# EAGLE design debug-board (EAGLE 9.6.2)
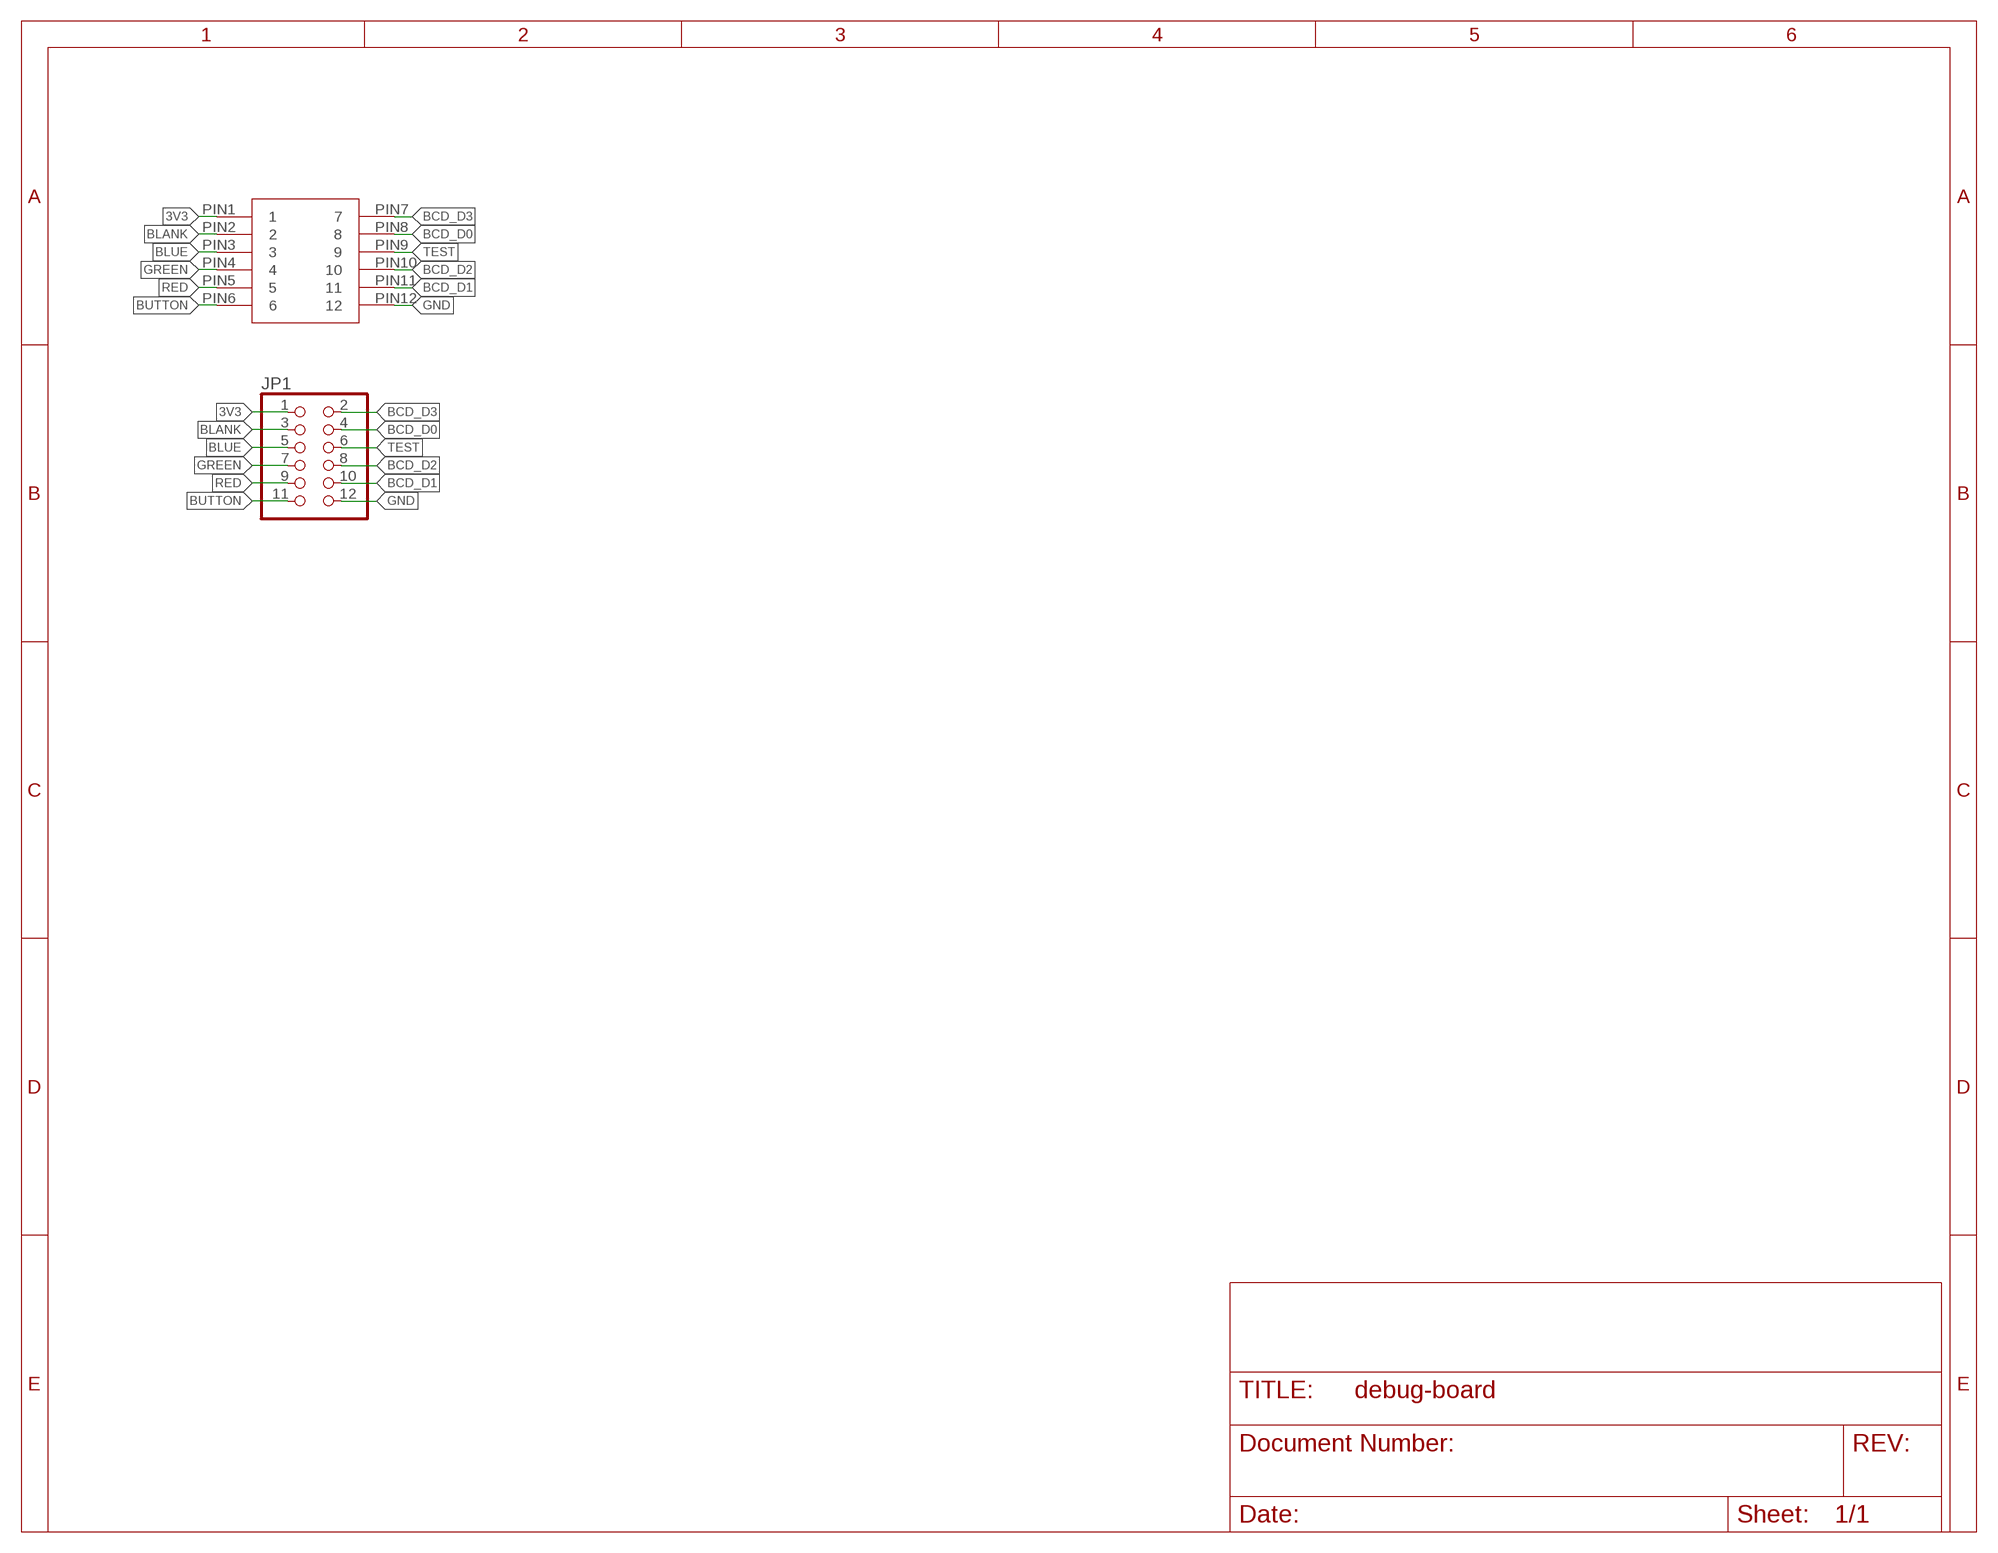
[diagram p0: schematic, sheet 1]

## Parts
JP1  PINHD-2X6  [2X06]
U$1  5650118-3  [5650118-3]

## Nets
3V3: JP1.1 U$1.PIN1
BCD_D0: JP1.4 U$1.PIN8
BCD_D1: JP1.10 U$1.PIN11
BCD_D2: JP1.8 U$1.PIN10
BCD_D3: JP1.2 U$1.PIN7
BLANK: JP1.3 U$1.PIN2
BLUE: JP1.5 U$1.PIN3
BUTTON: JP1.11 U$1.PIN6
GND: JP1.12 U$1.PIN12
GREEN: JP1.7 U$1.PIN4
RED: JP1.9 U$1.PIN5
TEST: JP1.6 U$1.PIN9

## Library data of the parts
JP1 = pinhead:PINHD-2X6: PIN HEADER
U$1 = 5650118-3:5650118-3

## Board
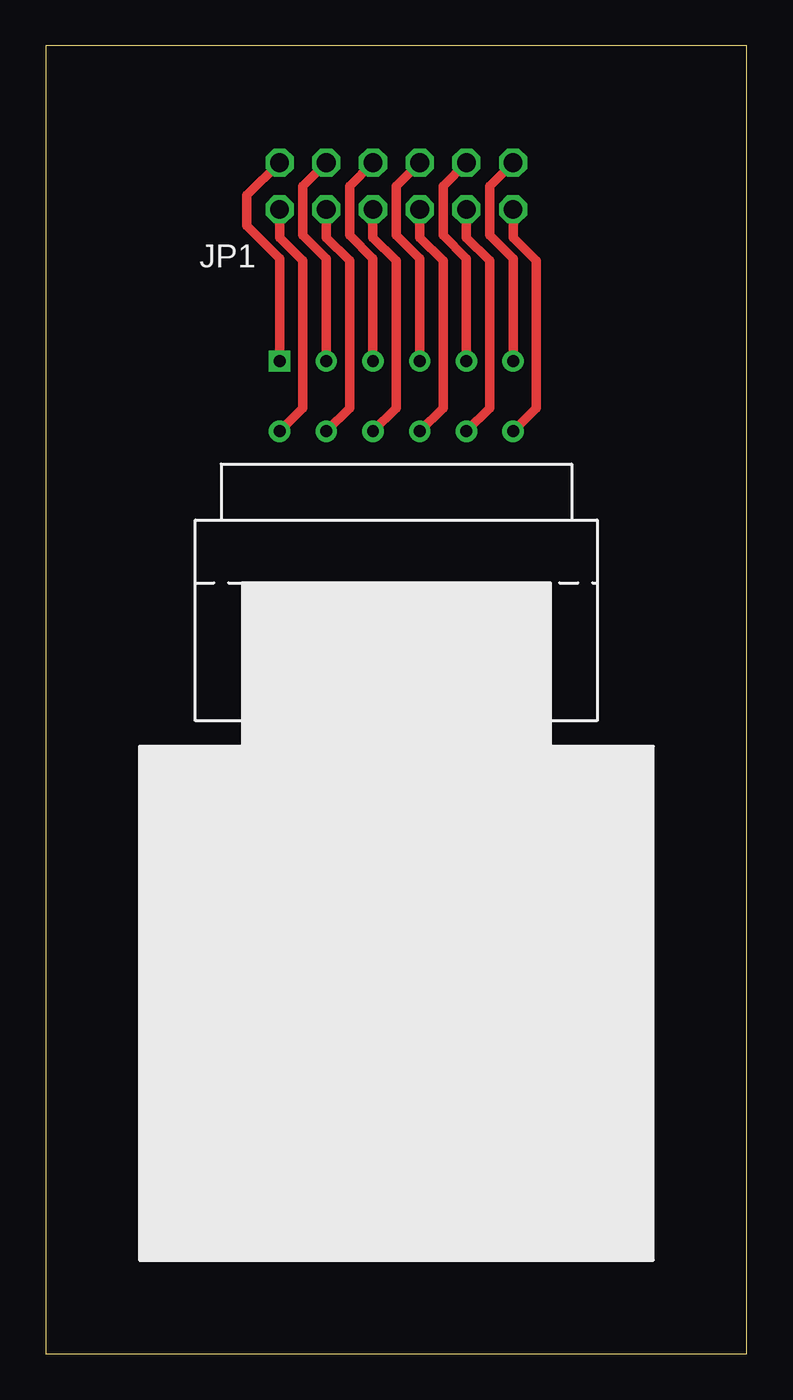
[diagram p1: board, top side]
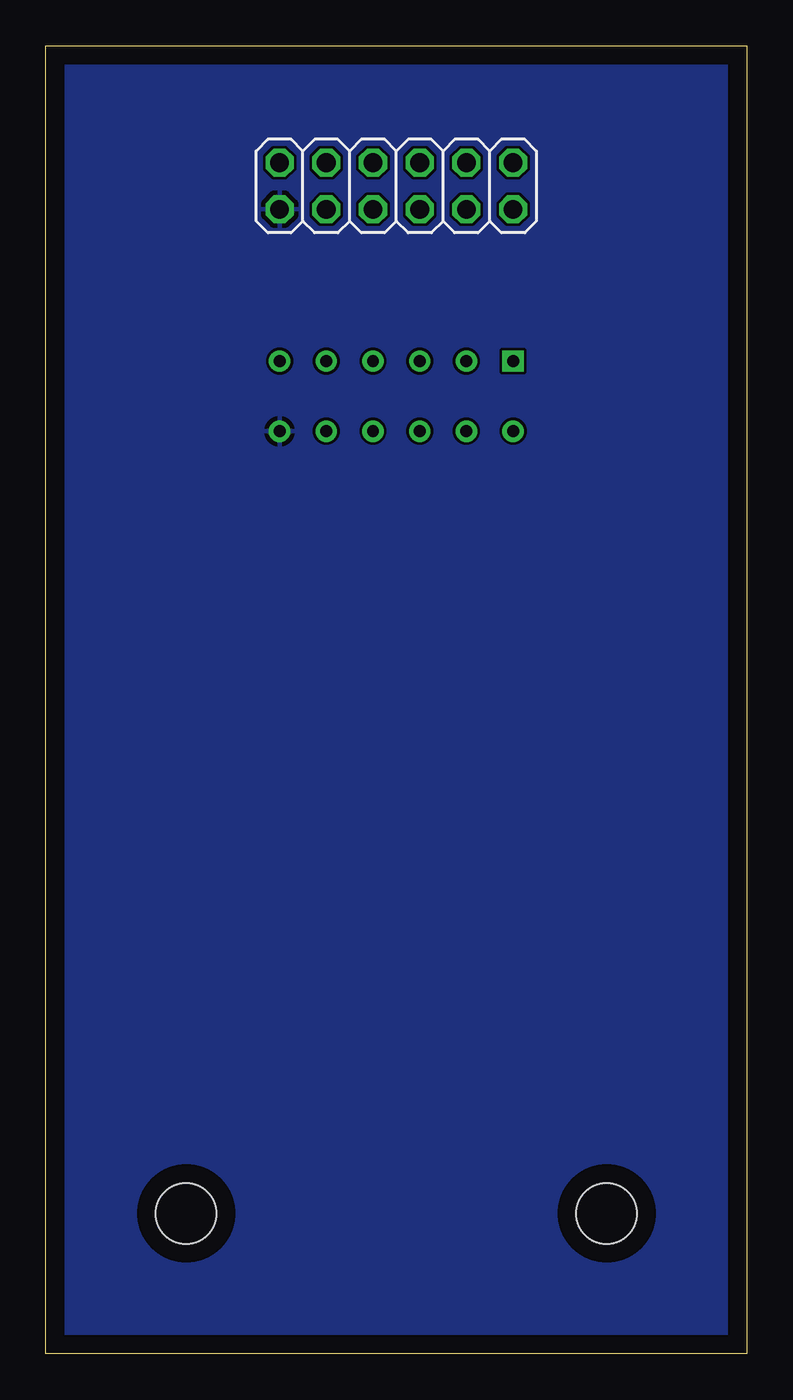
[diagram p2: board, bottom side, seen from below]

Size 38.1 x 71.12 mm. Coordinates in mm from the lower left corner, seen from the top.
Outline: 0,0 38.1,0 38.1,71.12 0,71.12 0,0
Copper layers (1*16): Top 0.035mm / dielectric 1.5mm / Bottom 0.035mm
Design rules "default": minimum track width 6mil, minimum drill 0.35mm, track to track 6mil, track to pad 6mil, pad to pad 6mil, via to via 6mil, smd to smd 6mil, copper to edge 40mil, drill to drill 6mil, minimum pad ring 10mil, minimum via ring 8mil, stop-mask expansion 4mil, vias tented up to drill 0mil, thermal gap 10mil
Holes 3.3 mm at 7.62,7.62 30.48,7.62

### Footprints (pad centres in the part's own frame; a part is rotated, then mirrored left to right if it is on the bottom)
2X06 = drill 1.016 octagon: 1 -6.35,-1.27; 2 -6.35,1.27; 3 -3.81,-1.27; 4 -3.81,1.27; 5 -1.27,-1.27; 6 -1.27,1.27; 7 1.27,-1.27; 8 1.27,1.27; 9 3.81,-1.27; 10 3.81,1.27; 11 6.35,-1.27; 12 6.35,1.27
5650118-3 = drill 0.65 square: PIN1 -6.35,3.81 | drill 0.65: PIN2 -3.81,3.81; PIN3 -1.27,3.81; PIN4 1.27,3.81; PIN5 3.81,3.81; PIN6 6.35,3.81; PIN7 -6.35,0; PIN8 -3.81,0; PIN9 -1.27,0; PIN10 1.27,0; PIN11 3.81,0; PIN12 6.35,0

### Placement (x,y rotation side)
JP1  19.05,63.5 180 bottom
U$1  19.05,50.16 0 top

### Tracks (layer width: path | path; a pad name or v marks a point on that pad's centre or on a via)
3V3
  Top 0.508: U$1.PIN1 12.7,59.56 10.92,61.34 10.92,62.99 JP1.1
BCD_D0
  Top 0.508: U$1.PIN8 16.51,51.44 16.51,59.44 15.24,60.71 JP1.4
BCD_D1
  Top 0.508: U$1.PIN11 24.13,51.44 24.13,59.44 22.86,60.71 JP1.10
BCD_D2
  Top 0.508: U$1.PIN10 21.59,51.44 21.59,59.44 20.32,60.71 JP1.8
BCD_D3
  Top 0.508: U$1.PIN7 13.97,51.44 13.97,59.44 12.7,60.71 JP1.2
BLANK
  Top 0.508: U$1.PIN2 15.24,59.56 13.97,60.83 13.97,63.5 JP1.3
BLUE
  Top 0.508: U$1.PIN3 17.78,59.56 16.51,60.83 16.51,63.5 JP1.5
BUTTON
  Top 0.508: U$1.PIN6 25.4,59.56 24.13,60.83 24.13,63.5 JP1.11
GND
  Top 0.508: U$1.PIN12 26.67,51.44 26.67,59.44 25.4,60.71 JP1.12
  pour Bottom: -5.08,76.2 -5.08,-5.08 43.18,-5.08 43.18,76.2
GREEN
  Top 0.508: U$1.PIN4 20.32,59.56 19.05,60.83 19.05,63.5 JP1.7
RED
  Top 0.508: U$1.PIN5 22.86,59.56 21.59,60.83 21.59,63.5 JP1.9
TEST
  Top 0.508: U$1.PIN9 19.05,51.44 19.05,59.44 17.78,60.71 JP1.6